# EAGLE design AirSensor (EAGLE 7.5.0)
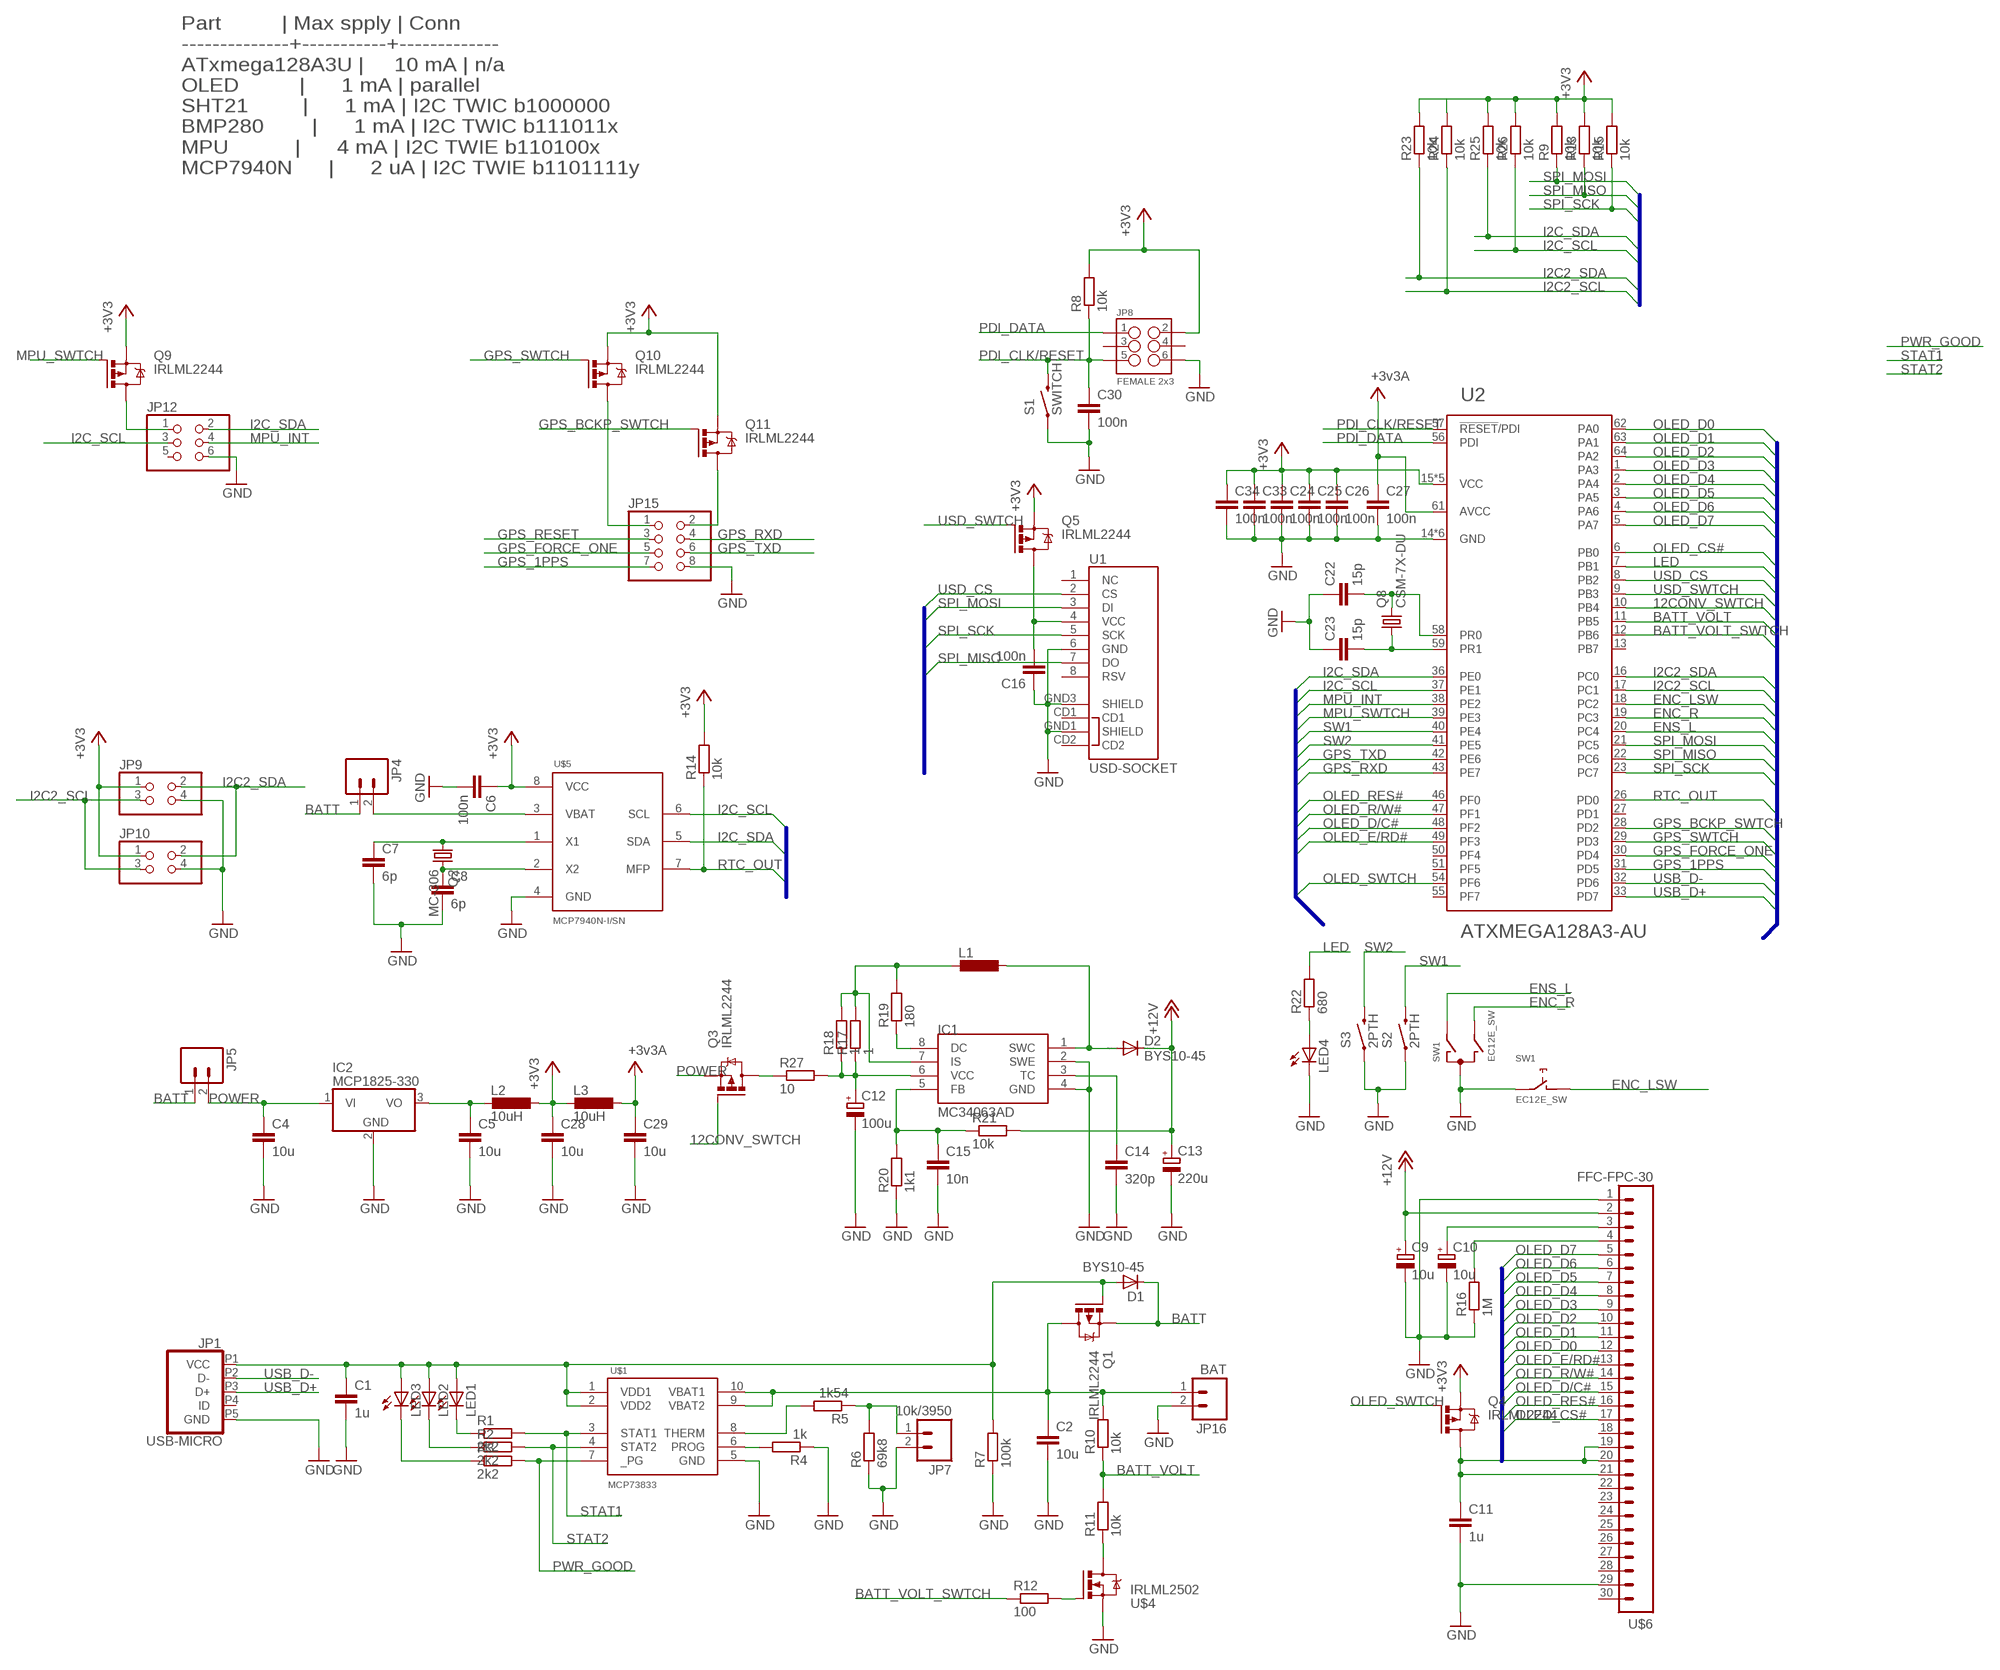
[diagram p0: schematic, sheet 1]

## Parts
C1  1u  C-EUC1206  [C1206]
C2  10u  C-EUC0805  [C0805]
C4  10u  C-EUC0805  [C0805]
C5  10u  C-EUC0805  [C0805]
C6  100n  C-EUC0805  [C0805]
C7  6p  C-EUC0805  [C0805]
C8  6p  C-EUC0805  [C0805]
C9  10u  CPOL-EUUD-4X5,8  [UD-4X5,8_NICHICON]
C10  10u  CPOL-EUUD-4X5,8  [UD-4X5,8_NICHICON]
C11  1u  C-EUC0805  [C0805]
C12  100u  CPOL-EUSANYO_SMD_C6  [SANYO-OSCON_SMD_C6]
C13  220u  CPOL-EUSANYO_SMD_C6  [SANYO-OSCON_SMD_C6]
C14  320p  C-EUC0805  [C0805]
C15  10n  C-EUC0805  [C0805]
C16  100n  C-EUC0805  [C0805]
C22  15p  C-EUC0805  [C0805]
C23  15p  C-EUC0805  [C0805]
C24  100n  C-EUC0805  [C0805]
C25  100n  C-EUC0805  [C0805]
C26  100n  C-EUC0805  [C0805]
C27  100n  C-EUC0805  [C0805]
C28  10u  C-EUC0805  [C0805]
C29  10u  C-EUC0805  [C0805]
C30  100n  C-EUC0805  [C0805]
C33  100n  C-EUC0805  [C0805]
C34  100n  C-EUC0805  [C0805]
D1  BYS10-45  BYS10  [SOD106A]
D2  BYS10-45  MBR0520LT  [SOD123]
IC1  MC34063AD  [SOIC8]
IC2  MCP1825-330  MCP1703DB  [SOT223]
JP1  USB-MICRO  [HIROSE-ZX62-AB-5PA(11)]
JP4  M02PTH  [1X02]
JP5  M02PTH  [1X02]
JP7  10k/3950  M02PTH  [1X02]
JP8  FEMALE 2x3  M03X2FEMALE  [2X3]
JP9  PINHD-2X2/90-SOCKET  [2X02S/90]
JP10  PINHD-2X2/90-SOCKET  [2X02S/90]
JP12  PINHD-2X3/90-SOCKET  [2X03S/90]
JP15  PINHD-2X4/90-SOCKET  [2X04S/90]
JP16  BAT  M02PTH  [1X02]
L1  L-EUTFI0307  [TFI0307]
L2  10uH  L-EUL3225P  [L3225P]
L3  10uH  L-EUL3225P  [L3225P]
LED1  LEDCHIPLED_1206  [CHIPLED_1206]
LED2  LEDCHIPLED_1206  [CHIPLED_1206]
LED3  LEDCHIPLED_1206  [CHIPLED_1206]
LED4  LEDSML1206  [SML1206]
Q1  IRLML2244  IRLML5203  [MICRO3]
Q2  MC-306  [MC-306]
Q3  IRLML2244  IRLML5203  [MICRO3]
Q4  IRLML2244  IRLML5203  [MICRO3]
Q5  IRLML2244  IRLML5203  [MICRO3]
Q8  CSM-7X-DU  [CSM-7X-DU]
Q9  IRLML2244  IRLML5203  [MICRO3]
Q10  IRLML2244  IRLML5203  [MICRO3]
Q11  IRLML2244  IRLML5203  [MICRO3]
R1  2k2  R-EU_R0805  [R0805]
R2  2k2  R-EU_R0805  [R0805]
R3  2k2  R-EU_R0805  [R0805]
R4  1k  R-EU_R0805  [R0805]
R5  1k54  R-EU_R0805  [R0805]
R6  69k8  R-EU_R0805  [R0805]
R7  100k  R-EU_R0805  [R0805]
R8  10k  R-EU_R0805  [R0805]
R9  10k  R-EU_R0805  [R0805]
R10  10k  R-EU_R0805  [R0805]
R11  10k  R-EU_R0805  [R0805]
R12  100  R-EU_R0805  [R0805]
R13  10k  R-EU_R0805  [R0805]
R14  10k  R-EU_R0805  [R0805]
R15  10k  R-EU_R0805  [R0805]
R16  1M  R-EU_R1206  [R1206]
R17  1  R-EU_R0805  [R0805]
R18  1  R-EU_R0805  [R0805]
R19  180  R-EU_R0805  [R0805]
R20  1k1  R-EU_R0805  [R0805]
R21  10k  R-EU_R0805  [R0805]
R22  680  R-EU_R0805  [R0805]
R23  10k  R-EU_R0805  [R0805]
R24  10k  R-EU_R0805  [R0805]
R25  10k  R-EU_R0805  [R0805]
R26  10k  R-EU_R0805  [R0805]
R27  10  R-EU_R1206  [R1206]
S1  SWITCH  SWITCH-MOMENTARY-2SIDE_EZ  [TACTILE-PTH-SIDEEZ]
S2  2PTH  SWITCH-MOMENTARY-2SMD-4  [TACTILE_SWITCH_TALL]
S3  2PTH  SWITCH-MOMENTARY-2SMD-4  [TACTILE_SWITCH_TALL]
SW1  EC12E_SW  [ALPS_EC12E_SW]
U1  USD-SOCKET  [MICROSD_1:1]
U2  ATXMEGA128A3-AU  [TQFP-64A-64]
U$1  MCP73833  [MSOP10]
U$4  IRLML2502  [MICRO3]
U$5  MCP7940N-I/SN  [SOIC8]
U$6  FFC-FPC-30  [FFC-FPC-30V]

## Nets
12CONV_SWTCH: Q3.1(G) U2.10(PB4)
+3V3: C6.1 C24.1 C25.1 C26.1 C28.1 C33.1 C34.1 JP8.2 JP9.1 JP10.1 L2.1 L3.2 Q4.2(S) Q5.2(S) Q9.2(S) Q10.2(S) Q11.2(S) R8.2 R9.2 R13.2 R14.2 R15.2 R23.2 R24.2 R25.2 R26.2 U2.15(VCC) U2.25(VCC) U2.35(VCC) U2.45(VCC) U2.53(VCC) U$5.8(VCC)
+12V: C9.+ C13.+ D2.C R21.2 U$6.2
BATT: D1.K JP4.1 JP5.1 Q1.2(S)
BATT_CHARGE: C2.1 JP16.1 Q1.3(D) R10.2 U$1.9(VBAT2) U$1.10(VBAT1)
BATT_VOLT: R10.1 R11.2 U2.11(PB5)
BATT_VOLT_SWTCH: R12.1 U2.12(PB6)
ENC_LSW: SW1.D U2.18(PC2)
ENC_R: SW1.B U2.19(PC3)
ENS_L: SW1.A U2.20(PC4)
GND: C1.2 C2.2 C4.2 C5.2 C6.2 C7.2 C8.2 C9.- C10.- C11.2 C12.- C13.- C14.2 C15.2 C16.1 C22.1 C23.1 C24.2 C25.2 C26.2 C27.2 C28.2 C29.2 C30.2 C33.2 C34.2 IC1.2(SWE) IC1.4(GND) IC2.2(GND) JP1.P5(GND) JP7.2 JP8.6 JP9.4 JP10.4 JP12.6 JP15.8 JP16.2 LED4.C R4.1 R6.1 R7.1 R16.1 R20.1 S1.1 S2.A2 S3.A2 SW1.C SW1.E U1.6(GND) U1.GND1(SHIELD) U1.GND3(SHIELD) U2.14(GND) U2.24(GND) U2.34(GND) U2.44(GND) U2.52(GND) U2.60(GND) U$1.5(GND) U$4.2(S) U$5.4(GND) U$6.1 U$6.29
GPS_1PPS: JP15.7 U2.31(PD5)
GPS_BCKP_SWTCH: Q11.1(G) U2.28(PD2)
GPS_FORCE_ONE: JP15.5 U2.30(PD4)
GPS_RESET: JP15.3
GPS_RXD: JP15.4 U2.43(PE7)
GPS_SWTCH: Q10.1(G) U2.29(PD3)
GPS_TXD: JP15.6 U2.42(PE6)
I2C2_SCL: JP9.3 JP10.3 R24.1 U2.17(PC1)
I2C2_SDA: JP9.2 JP10.2 R23.1 U2.16(PC0)
I2C_SCL: JP12.3 R26.1 U2.37(PE1) U$5.6(SCL)
I2C_SDA: JP12.2 R25.1 U2.36(PE0) U$5.5(SDA)
LED: R22.2 U2.7(PB1)
MPU_INT: JP12.4 U2.38(PE2)
MPU_SWTCH: Q9.1(G) U2.39(PE3)
N$1: LED1.C R1.1
N$2: C1.1 D1.A JP1.P1(VCC) LED1.A LED2.A LED3.A Q1.1(G) R7.2 U$1.1(VDD1) U$1.2(VDD2)
N$3: C7.1 Q2.1 U$5.1(X1)
N$4: C8.1 Q2.4 U$5.2(X2)
N$5: JP4.2 U$5.3(VBAT)
N$6: LED2.C R2.1
N$7: LED3.C R3.1
N$8: R4.2 U$1.6(PROG)
N$9: R12.2 U$4.1(G)
N$10: R5.2 U$1.8(THERM)
N$11: JP7.1 R5.1 R6.2
N$13: Q3.3(D) R27.1
N$17: R11.1 U$4.3(D)
N$18: C12.+ IC1.6(VCC) R17.1 R18.1 R27.2
N$19: C10.+ U$6.3
N$20: C11.1 Q4.3(D) U$6.19 U$6.20 U$6.21
N$21: IC1.7(IS) L1.2 R17.2 R18.2 R19.2
N$22: R16.2 U$6.4
N$23: IC1.8(DC) R19.1
N$24: D2.A IC1.1(SWC) L1.1
N$25: C14.1 IC1.3(TC)
N$26: C15.1 IC1.5(FB) R20.2 R21.1
N$27: C16.2 Q5.3(D) U1.4(VCC)
N$30: C22.2 Q8.2 U2.58(PR0)
N$31: C23.2 Q8.1 U2.59(PR1)
N$32: C5.1 IC2.3(VO) L2.2
N$33: LED4.A R22.1
N$34: JP12.1 Q9.3(D)
N$39: JP15.1 Q10.3(D)
N$40: JP15.2 Q11.3(D)
OLED_CS#: U2.6(PB0) U$6.17
OLED_D0: U2.62(PA0) U$6.12
OLED_D1: U2.63(PA1) U$6.11
OLED_D2: U2.64(PA2) U$6.10
OLED_D3: U2.1(PA3) U$6.9
OLED_D4: U2.2(PA4) U$6.8
OLED_D5: U2.3(PA5) U$6.7
OLED_D6: U2.4(PA6) U$6.6
OLED_D7: U2.5(PA7) U$6.5
OLED_D/C#: U2.48(PF2) U$6.15
OLED_E/RD#: U2.49(PF3) U$6.13
OLED_R/W#: U2.47(PF1) U$6.14
OLED_RES#: U2.46(PF0) U$6.16
OLED_SWTCH: Q4.1(G) U2.54(PF6)
PDI_CLK/RESET: C30.1 JP8.5 R8.1 S1.2 U2.57(!RESET!/PDI)
PDI_DATA: JP8.1 U2.56(PDI)
POWER: C4.1 IC2.1(VI) JP5.2 Q3.2(S)
PWR_GOOD: R3.2 U$1.7(_PG)
RTC_OUT: R14.1 U2.26(PD0) U$5.7(MFP)
SPI_MISO: R13.1 U1.7(DO) U2.22(PC6)
SPI_MOSI: R9.1 U1.3(DI) U2.21(PC5)
SPI_SCK: R15.1 U1.5(SCK) U2.23(PC7)
STAT1: R1.2 U$1.3(STAT1)
STAT2: R2.2 U$1.4(STAT2)
SW1: S2.B2 U2.40(PE4)
SW2: S3.B2 U2.41(PE5)
USB_D+: JP1.P3(D+) U2.33(PD7)
USB_D-: JP1.P2(D-) U2.32(PD6)
USD_CS: U1.2(CS) U2.8(PB2)
USD_SWTCH: Q5.1(G) U2.9(PB3)
V+: C27.1 C29.1 L3.1 U2.61(AVCC) ; supply symbol labelled +3v3A
Unconnected: JP1.P4(ID) JP8.3 JP8.4 JP12.5 SW1.GND1(G) SW1.GND2(G) U1.1(NC) U1.8(RSV) U1.CD1 U1.CD2 U2.13(PB7) U2.27(PD1) U2.50(PF4) U2.51(PF5) U2.55(PF7) U$6.18 U$6.22 U$6.23 U$6.24 U$6.25 U$6.26 U$6.27 U$6.28 U$6.30

## Buses
B$1
B$2
B$3
B$5
B$4

## Notes on the sheet
- Part          | Max spply | Conn
  --------------+-----------+-------------
  ATxmega128A3U |     10 mA | n/a
  OLED          |      1 mA | parallel
  SHT21         |      1 mA | I2C TWIC b1000000
  BMP280        |      1 mA | I2C TWIC b111011x
  MPU           |      4 mA | I2C TWIE b110100x
  MCP7940N      |      2 uA | I2C TWIE b1101111y

## Library data of the parts
C1 C2 C4-C8 C11 C14-C16 C22-C30 C33 C34 = rcl:C-EU: CAPACITOR, European symbol
C9 C10 C12 C13 = rcl:CPOL-EU: POLARIZED CAPACITOR, European symbol
D1 = telefunken:BYS10: DIODE; MPN: BYS10/45; OC_FARNELL: 9549188; OC_NEWARK: 96K7236
D2 = diode:MBR0520LT: SCHOTTKY BARRIER RECTIFIER Source: http://onsemi.com .. MBR0520LT1-D.pdf
IC1 = mc34063:MC34063
IC2 = linear:MCP1703: 250 mA, 16V, Low Quiescent Current LDO Regulator Source: http://ww1.microchip.com/downloads/en/DeviceDoc/22049b.pdf
JP1 = daspilker:USB-MICRO
JP4 JP5 JP7 JP16 = SparkFun-Connectors:M02: Standard 2-pin 0.1" header. Use with - straight break away headers ( PRT-00116) - right angle break away headers (PRT-00553) - swiss pins (PRT-00743) - machine pins (PRT-00117) - female headers (PRT-00115) Molex polarized connector foot print use with: PRT-08233 with associated crimp pins and housings. 2.54_SCREWTERM for use with PRT-10571. 3.5mm Screw Terminal footprints for PRT-08084 5mm Screw Terminal footprints for use with PRT-08432
JP8 = SparkFun-Connectors:M03X2: 2x3 .1" header. Shrouded, with keying- CONN-10681 SMT- CONN-11415 Pogo pins- HW-11044; PROD_ID: CONN-11566
JP9 JP10 = Misc:PINHD-2X2: PIN HEADER
JP12 = Misc:PINHD-2X3: PIN HEADER
JP15 = Misc:PINHD-2X4: PIN HEADER
L1-L3 = rcl:L-EU: INDUCTOR, European symbol
LED1-LED4 = led:LED: LED OSRAM: - CHIPLED LG R971, LG N971, LY N971, LG Q971, LY Q971, LO R971, LY R971 LH N974, LH R974 LS Q976, LO Q976, LY Q976 LO Q996 - Hyper CHIPLED LW Q18S LB Q993, LB Q99A, LB R99A - SideLED LS A670, LO A670, LY A670, LG A670, LP A670 LB A673, LV A673, LT A673, LW A673 LH A674 LY A675 LS A676, LA A676, LO A676, LY A676, LW A676 LS A679, LY A679, LG A679 - Hyper Micro SIDELED® LS Y876, LA Y876, LO Y876, LY Y876 LT Y87S - SmartLED LW L88C, LW L88S LB L89C, LB L89S, LG L890 LS L89K, LO L89K, LY L89K LS L896, LA L896, LO L896, LY L896 - TOPLED LS T670, LO T670, LY T670, LG T670, LP T670 LSG T670, LSP T670, LSY T670, LOP T670, LYG T670 LG T671, LOG T671, LSG T671 LB T673, LV T673, LT T673, LW T673 LH T674 LS T676, LA T676, LO T676, LY T676, LB T676, LH T676, LSB T676, LW T676 LB T67C, LV T67C, LT T67C, LS T67K, LO T67K, LY T67K, LW E67C LS E67B, LA E67B, LO E67B, LY E67B, LB E67C, LV E67C, LT E67C LW T67C LS T679, LY T679, LG T679 LS T770, LO T770, LY T770, LG T770, LP T770 LB T773, LV T773, LT T773, LW T773 LH T774 LS E675, LA E675, LY E675, LS T675 LS T776, LA T776, LO T776, LY T776, LB T776 LHGB T686 LT T68C, LB T68C - Hyper Mini TOPLED® LB M676 - Mini TOPLED Santana® LG M470 LS M47K, LO M47K, LY M47K Source: http://www.osram.convergy.de LUXEON: - LUMILED® LXK2-PW12-R00, LXK2-PW12-S00, LXK2-PW14-U00, LXK2-PW14-V00 LXK2-PM12-R00, LXK2-PM12-S00, LXK2-PM14-U00 LXK2-PE12-Q00, LXK2-PE12-R00, LXK2-PE12-S00, LXK2-PE14-T00, LXK2-PE14-U00 LXK2-PB12-K00, LXK2-PB12-L00, LXK2-PB12-M00, LXK2-PB14-N00, LXK2-PB14-P00, LXK2-PB14-Q00 LXK2-PR12-L00, LXK2-PR12-M00, LXK2-PR14-Q00, LXK2-PR14-R00 LXK2-PD12-Q00, LXK2-PD12-R00, LXK2-PD12-S00 LXK2-PH12-R00, LXK2-PH12-S00 LXK2-PL12-P00, LXK2-PL12-Q00, LXK2-PL12-R00 Source: www.luxeon.com KINGBRIGHT: KA-3528ASYC Source: www.kingbright.com
Q1 Q3-Q5 Q9-Q11 = transistor-power:IRLML5203: HEXFET P-Channel Power MOSFET
Q2 = crystal:MC-306: kHz RANGE CRYSTAL UNIT SMD Source: MC-306_405_406_E07X.PDF Homepage <http://www.epsontoyocom.co.jp>; MPN: MC-306 60.0KHZ 100PPM ,12.5PF; OC_FARNELL: 1278040; OC_NEWARK: 31M5576
Q8 = crystal:CSM-7X-DU: SMD CRYSTAL Source: www.ecsxtal.com .. Crystal 3.6864MHz CSM_7X_DU.PDF; OC_FARNELL: unknown; OC_NEWARK: unknown
R1-R27 = rcl:R-EU_: RESISTOR, European symbol
S1 = SparkFun-Electromechanical:SWITCH-MOMENTARY-2: Various NO switches- pushbuttons, reed, etc
S2 S3 = SparkFun-Electromechanical:SWITCH-MOMENTARY-2: Various NO switches- pushbuttons, reed, etc; PROD_ID: SWCH-11966
SW1 = switch-alps:EC12E_SW: ALPS rotary Encoder EC12E series with switch; MPN: EC12E2424407; OC_FARNELL: 1520813; OC_NEWARK: 74M1068
U1 = SparkFun-Connectors:USD-SOCKET: microSD Socket Push-push type uSD socket. Schematic element and footprint production proven. Spark Fun Electronics SKU : PRT-00127. tDoc lines correctly indicate media card edge positions when inserting (unlocked, locked, depressed). NOTE: CD1 and CD2 are connected internally; PROD_ID: CONN-07820
U2 = atmega-atxmega:ATXMEGA128A3: 8/16-bit XMEGA A3 Microcontroller Features High-performance, Low-power 8/16-bit Atmel® AVR® XMEGATM Microcontroller Non-volatile Program and Data Memories – 64 KB - 256 KB of In-System Self-Programmable Flash – 4 KB - 8 KB Boot Code Section with Independent Lock Bits – 2 KB - 4 KB EEPROM – 4 KB - 16 KB Internal SRAM Peripheral Features – Four-channel DMA Controller with support for external requests – Eight-channel Event System – Seven 16-bit Timer/Counters Four Timer/Counters with 4 Output Compare or Input Capture channels Three Timer/Counters with 2 Output Compare or Input Capture channels High Resolution Extensions on all Timer/Counters Advanced Waveform Extension on one Timer/Counter – Seven USARTs IrDA Extension on 1 USART – AES and DES Crypto Engine – Two Two-wire Interfaces with dual address match (I2C and SMBus compatible) – Three SPI (Serial Peripheral Interfaces) – 16-bit Real Time Counter with Separate Oscillator – Two Eight-channel, 12-bit, 2 Msps Analog to Digital Converters – One Two-channel, 12-bit, 1 Msps Digital to Analog Converter – Four Analog Comparators with Window compare function – External Interrupts on all General Purpose I/O pins – Programmable Watchdog Timer with Separate On-chip Ultra Low Power Oscillator Special Microcontroller Features – Power-on Reset and Programmable Brown-out Detection – Internal and External Clock Options with PLL – Programmable Multi-level Interrupt Controller – Sleep Modes: Idle, Power-down, Standby, Power-save, Extended Standby – Advanced Programming, Test and Debugging Interfaces JTAG (IEEE 1149.1 Compliant) Interface for test, debug and programming PDI (Program and Debug Interface) for programming, test and debugging I/O and Packages – 50 Programmable I/O Lines – 64-lead TQFP – 64-pad QFN Operating Voltage – 1.6 – 3.6V Speed performance – 0 – 12 MHz @ 1.6 – 3.6V – 0 – 32 MHz @ 2.7 – 3.6V
U$1 = Misc:MCP73833
U$4 = Misc:IRLML2502: HEXFET N-Channel Power MOSFET
U$5 = Misc:MCP7940N: Battery-Backed I2C™ Real-Time Clock/Calendar with SRAM
U$6 = Misc:FFC-FPC-30

## Board
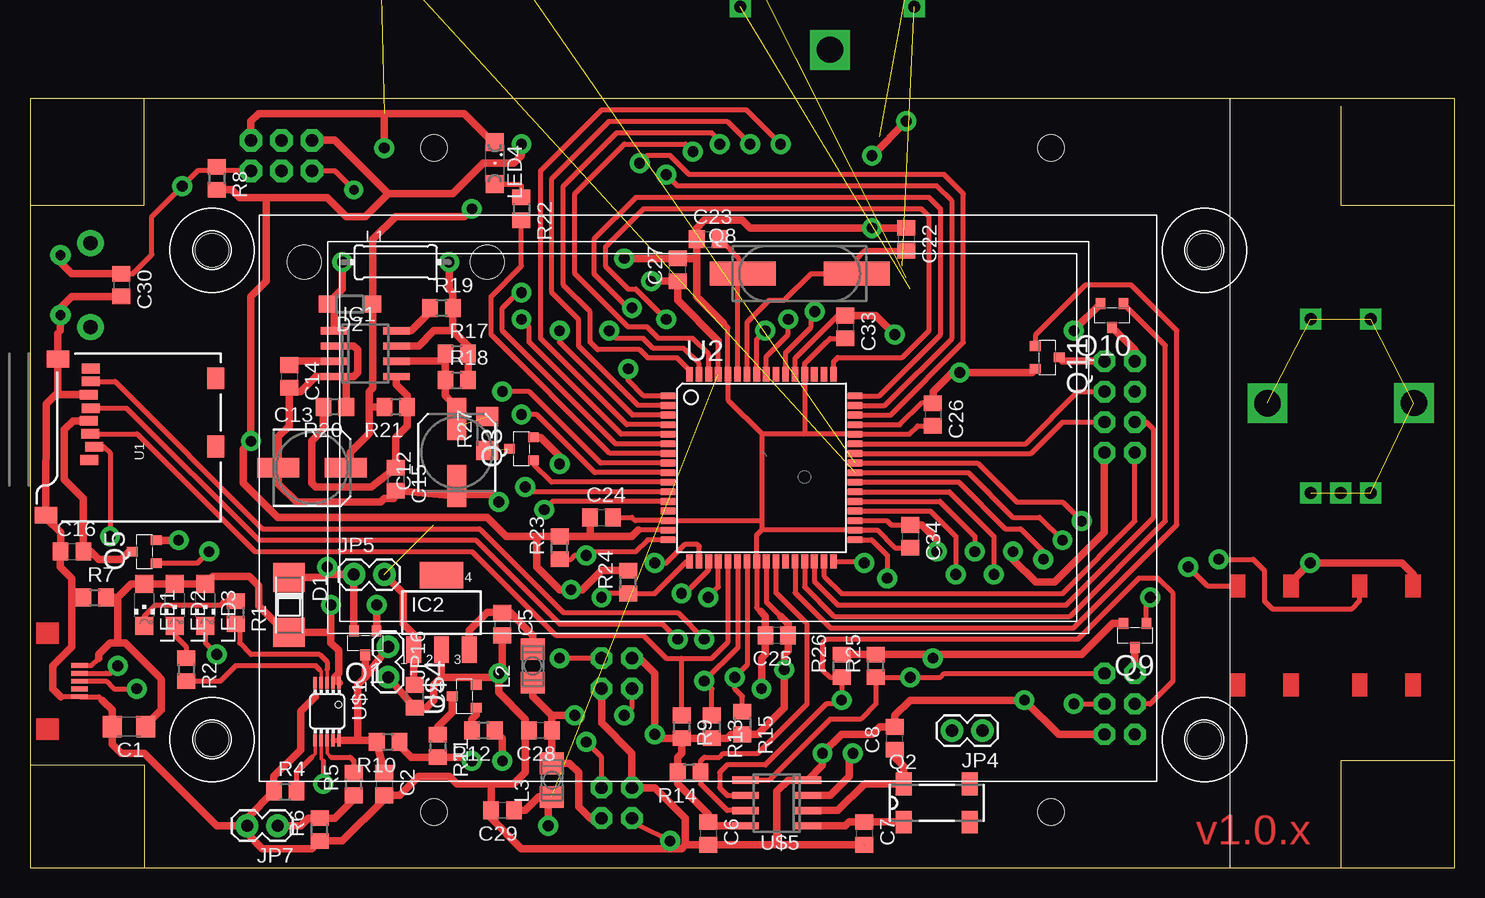
[diagram p1: board, top side]
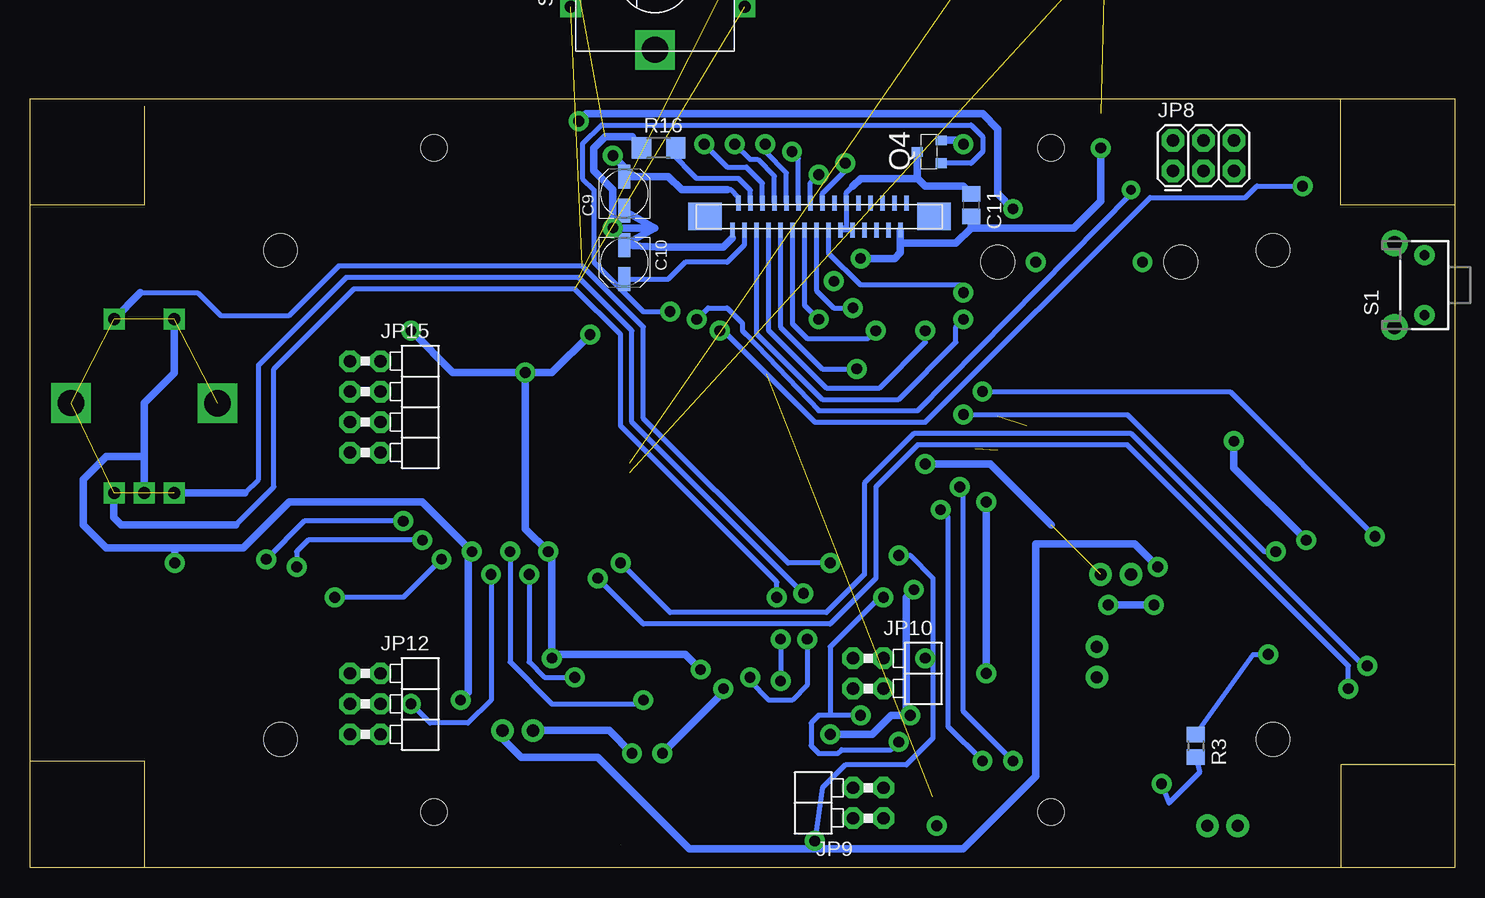
[diagram p2: board, bottom side, seen from below]

Size 118.75 x 64.14 mm. Coordinates in mm from the lower left corner, seen from the top.
Outline: 9.53,0 0,0 0,8.57
Outline: 9.53,0 109.22,0
Outline: 0,55.24 0,64.12 118.75,64.12 118.75,55.24
Outline: 0,55.24 0,8.57
Outline: 109.22,0 118.75,0 118.75,8.89
Outline: 118.75,8.89 118.75,55.24
Outline: 0,55.24 9.53,55.24 9.53,64.14
Outline: 0,8.57 9.53,8.57 9.53,0
Outline: 118.75,8.89 109.22,8.89 109.22,0
Outline: 109.22,63.5 109.22,55.24 118.75,55.24
Copper layers (1*16): Top 0.035mm / dielectric 1.5mm / Bottom 0.035mm
Design rules "default *": minimum track width 10mil, minimum drill 24mil, track to track 8mil, track to pad 8mil, pad to pad 8mil, via to via 8mil, smd to smd 8mil, copper to edge 40mil, drill to drill 8mil, minimum pad ring 15mil, minimum via ring 15mil, stop-mask expansion 4mil, vias tented up to drill 0mil, thermal gap 10mil
Holes 2.2 mm at 33.66,60.01 85.09,60.01 85.09,4.64 33.66,4.64
Holes 2.8 mm at 38.1,50.48 22.86,50.48

### Footprints (pad centres in the part's own frame; a part is rotated, then mirrored left to right if it is on the bottom)
C1206 = smd 1.6 x 1.8: 1 -1.4,0; 2 1.4,0
C0805 = smd 1.3 x 1.5: 1 -0.95,0; 2 0.95,0
UD-4X5,8_NICHICON = smd 2 x 1: + 1.425,0; - -1.425,0
SANYO-OSCON_SMD_C6 = smd 3.5 x 1.6: + 2.8,0; - -2.8,0
SOD106A = smd 2.4 x 2.6: A 2.3,0; K -2.3,0
SOD123 = smd 1.4 x 1.4: A 1.9,0; C -1.9,0
SOIC8 = smd 0.6 x 2.2: 1 -1.905,-2.6; 2 -0.635,-2.6; 3 0.635,-2.6; 4 1.905,-2.6; 5 1.905,2.6; 6 0.635,2.6; 7 -0.635,2.6; 8 -1.905,2.6
SOT223 = smd 1.219 x 2.235: 1 -2.311,-3.099; 2 0,-3.099; 3 2.311,-3.099 | smd 3.6 x 2.2: 4 0,3.099
HIROSE-ZX62-AB-5PA(11) = smd 0.4 x 1.35 bottom: P1 1.3,4.125; P2 0.65,4.125; P3 0,4.125; P4 -0.65,4.125; P5 -1.3,4.125
1X02 = drill 1.016 pad 1.88: 1 0,0; 2 2.54,0
2X3 = drill 1.016 pad 1.88 octagon: 1 0,0; 2 0,2.54; 3 2.54,0; 4 2.54,2.54; 5 5.08,0; 6 5.08,2.54
2X02S/90 = drill 1.016 octagon: 1 -1.27,-6.35; 2 -1.27,-3.81; 3 1.27,-6.35; 4 1.27,-3.81
2X03S/90 = drill 1.016 octagon: 1 -2.54,-6.35; 2 -2.54,-3.81; 3 0,-6.35; 4 0,-3.81; 5 2.54,-6.35; 6 2.54,-3.81
2X04S/90 = drill 1.016 octagon: 1 -3.81,-6.35; 2 -3.81,-3.81; 3 -1.27,-6.35; 4 -1.27,-3.81; 5 1.27,-6.35; 6 1.27,-3.81; 7 3.81,-6.35; 8 3.81,-3.81
TFI0307 = drill 0.9 pad 1.5: 1 -4.445,0; 2 4.445,0
L3225P = smd 1.8 x 2: 1 -1.4,0; 2 1.4,0
CHIPLED_1206 = smd 1.5 x 1.5: A 0,-1.75; C 0,1.75
SML1206 = smd 1.5 x 1.5: A 1.75,0; C -1.75,0
MICRO3 = smd 0.8 x 0.9: 1 -0.95,-1; 2 0.95,-1; 3 0,1
MC-306 = smd 1.3 x 1.9: 1 -2.75,-1.6; 2 2.75,-1.6; 3 2.75,1.6; 4 -2.75,1.6
CSM-7X-DU = smd 5.5 x 2: 1 -4.75,0; 2 4.75,0
R0805 = smd 1.3 x 1.5: 1 -0.95,0; 2 0.95,0
R1206 = smd 1.6 x 1.803: 1 -1.422,0; 2 1.422,0
TACTILE-PTH-SIDEEZ = drill 0.8 pad 1.7: 1 -2.5,0; 2 2.5,0 | drill 1.2 pad 2.2: ANCHOR1 -3.5,2.5; ANCHOR2 3.5,2.5
TACTILE_SWITCH_TALL = smd 1.55 x 1.3: A1 -3.975,-2.25; A2 3.975,-2.25; B1 -3.975,2.25; B2 3.975,2.25
ALPS_EC12E_SW = drill 1 square: A -2.5,-7.5; B 2.5,-7.5; C 0,-7.5; D -2.5,7; E 2.5,7 | drill 2.2 square: GND1 -6.1,0; GND2 6.1,0
MICROSD_1:1 = smd 0.8 x 1.5: 1 5.096,10.919; 2 6.218,10.519; 3 7.274,10.853; 4 8.367,10.982; 5 9.421,10.828; 6 10.539,10.973; 7 11.648,10.819; 8 12.721,10.819 | smd 1.8 x 1.4: CD1 11.92,0.4; CD2 6.22,0.4 | smd 1.4 x 1.9: GND1 0.497,14.55; GND3 13.52,13.55
TQFP-64A-64 = smd 1.194 x 0.559: 1 -7.8,6; 2 -7.8,5.2; 3 -7.8,4.4; 4 -7.8,3.6; 5 -7.8,2.8; 6 -7.8,2; 7 -7.8,1.2; 8 -7.8,0.4; 9 -7.8,-0.4; 10 -7.8,-1.2; 11 -7.8,-2; 12 -7.8,-2.8; 13 -7.8,-3.6; 14 -7.8,-4.4; 15 -7.8,-5.2; 16 -7.8,-6; 33 7.8,-6; 34 7.8,-5.2; 35 7.8,-4.4; 36 7.8,-3.6; 37 7.8,-2.8; 38 7.8,-2; 39 7.8,-1.2; 40 7.8,-0.4; 41 7.8,0.4; 42 7.8,1.2; 43 7.8,2; 44 7.8,2.8; 45 7.8,3.6; 46 7.8,4.4; 47 7.8,5.2; 48 7.8,6 | smd 0.559 x 1.194: 17 -6,-7.8; 18 -5.2,-7.8; 19 -4.4,-7.8; 20 -3.6,-7.8; 21 -2.8,-7.8; 22 -2,-7.8; 23 -1.2,-7.8; 24 -0.4,-7.8; 25 0.4,-7.8; 26 1.2,-7.8; 27 2,-7.8; 28 2.8,-7.8; 29 3.6,-7.8; 30 4.4,-7.8; 31 5.2,-7.8; 32 6,-7.8; 49 6,7.8; 50 5.2,7.8; 51 4.4,7.8; 52 3.6,7.8; 53 2.8,7.8; 54 2,7.8; 55 1.2,7.8; 56 0.4,7.8; 57 -0.4,7.8; 58 -1.2,7.8; 59 -2,7.8; 60 -2.8,7.8; 61 -3.6,7.8; 62 -4.4,7.8; 63 -5.2,7.8; 64 -6,7.8
MSOP10 = smd 0.3 x 1.02: 1 -1,-2.4; 2 -0.5,-2.4; 3 0,-2.4; 4 0.5,-2.4; 5 1,-2.4; 6 1,2.4; 7 0.5,2.4; 8 0,2.4; 9 -0.5,2.4; 10 -1,2.4
FFC-FPC-30V = smd 0.4 x 1.25: 1 -7.5,-1.125; 2 -7,1.125; 3 -6.5,-1.125; 4 -6,1.125; 5 -5.5,-1.125; 6 -5,1.125; 7 -4.5,-1.125; 8 -4,1.125; 9 -3.5,-1.125; 10 -3,1.125; 11 -2.5,-1.125; 12 -2,1.125; 13 -1.5,-1.125; 14 -1,1.125; 15 -0.5,-1.125; 16 0,1.125; 17 0.5,-1.125; 18 1,1.125; 19 1.5,-1.125; 20 2,1.125; 21 2.5,-1.125; 22 3,1.125; 23 3.5,-1.125; 24 4,1.125; 25 4.5,-1.125; 26 5,1.125; 27 5.5,-1.125; 28 6,1.125; 29 6.5,-1.125; 30 7,1.125 | smd 2.8 x 2.3: P$1 -9.8,0; P$2 9.3,0
RET012864LYPP3N = hole 2.8: -41.35,20.68; 41.35,20.68; -41.35,-20.1; 41.35,-20.1

### Placement (x,y rotation side)
C1  8.26,11.75 180 top
C2  29.53,6.99 270 top
C4  32.07,14.29 270 top
C5  39.37,20.32 270 top
C6  56.52,2.86 270 top
C7  69.53,2.86 270 top
C8  72.07,10.79 90 top
C9  69.22,56.2 90 bottom
C10  69.22,50.48 270 bottom
C11  40.32,55.24 270 bottom
C12  35.56,34.61 90 top
C13  23.5,33.34 0 top
C14  21.59,40.96 270 top
C15  30.48,32.38 270 top
C16  3.49,26.35 0 top
C22  73.03,52.39 270 top
C23  56.52,52.39 0 top
C24  47.62,29.21 0 top
C25  62.23,19.37 180 top
C26  75.25,37.78 270 top
C27  53.98,49.85 90 top
C28  42.55,11.43 180 top
C29  39.37,4.76 180 top
C30  7.62,48.58 270 top
C33  67.94,45.09 270 top
C34  73.34,27.62 270 top
D1  21.59,21.91 270 top
D2  26.67,46.99 180 top
IC1  27.94,42.86 270 top
IC2  34.29,21.27 0 top
JP1  0,15.56 90 bottom
JP4  79.38,11.43 180 top
JP5  26.99,24.45 0 top
JP7  20.64,3.49 180 top
JP8  23.5,58.1 0 bottom
JP9  53.98,5.4 90 bottom
JP10  43.81,16.19 270 bottom
JP12  85.72,13.65 270 bottom
JP15  85.72,38.42 270 bottom
JP16  29.84,18.41 270 top
L1  30.48,50.48 0 top
L2  41.91,16.83 90 top
L3  43.5,7.3 90 top
LED1  9.53,21.91 180 top
LED2  12.06,21.91 180 top
LED3  14.61,21.91 180 top
LED4  38.73,58.74 270 top
Q1  27.94,18.73 180 top
Q2  75.56,5.4 0 top
Q3  40.96,34.92 90 top
Q4  43.81,59.69 90 bottom
Q5  9.53,26.35 90 top
Q8  64.14,49.53 0 top
Q9  92.08,19.37 180 top
Q10  90.17,46.04 180 top
Q11  84.77,42.55 270 top
R1  17.14,21.27 270 top
R2  13.02,16.51 270 top
R3  21.59,10.16 270 bottom
R4  21.27,6.35 0 top
R5  26.99,6.99 90 top
R6  24.13,3.17 90 top
R7  5.4,22.54 0 top
R8  15.56,57.47 270 top
R9  54.29,11.75 270 top
R10  29.84,10.48 180 top
R11  33.97,10.16 270 top
R12  37.78,11.43 180 top
R13  56.83,11.75 270 top
R14  54.93,7.94 180 top
R15  59.37,12.06 270 top
R16  66.36,60.01 0 bottom
R17  35.56,42.86 0 top
R18  35.56,40.64 0 top
R19  34.29,46.67 0 top
R20  25.4,38.42 180 top
R21  30.48,38.42 180 top
R22  40.96,54.93 270 top
R23  44.13,26.67 90 top
R24  49.85,23.81 90 top
R25  70.48,16.83 90 top
R26  67.63,16.83 90 top
R27  38.1,36.2 90 top
S1  2.54,48.58 90 bottom
S2  33.02,78.74 180 top  (outside the outline)
S3  43.18,78.74 180 top  (outside the outline)
SW1  66.67,74.3 90 bottom  (outside the outline)
U1  15.88,28.89 90 top
U2  60.96,33.34 0 top
U$1  24.77,13.02 180 top
U$4  36.2,14.29 90 top
U$5  62.23,5.4 90 top
U$6  52.7,54.29 0 bottom
U$7  [RET012864LYPP3N]  56.52,30.8 0 top

### Tracks (layer width: path | path; a pad name or v marks a point on that pad's centre or on a via)
12CONV_SWTCH
  Top 0.406: U2.10 43.48,32.14 41.96,33.66 Q3.1 41.91,33.98
+3V3  (via drill 0.9)
  Top 0.406: 46.67,27.62 C24.1 | U2.15 50.68,28.14 | U2.25 61.36,22.14 62.55,20.95 | U2.53 63.76,42.49 67.31,46.04 C33.1 | U2.45 72.5,36.94 74.3,38.73 74.61,38.73 C26.1 | U2.35 71.39,28.94 71.75,28.57 73.02,28.57 C34.1
  Top 0.61: R9.2 R13.2 58.1,10.79 58.42,11.12 R15.2 60.65,11.11 60.96,11.43 62.87,13.34 v62.87,16.51 62.87,17.78 63.18,18.09 C25.1 63.18,20.32 62.55,20.95 | 46.67,27.62 50.16,27.62 50.68,28.14 | C34.1 73.03,28.57 74.3,28.57 75.56,27.3 v75.56,26.35 | C26.1 75.25,39.69 75.88,40.32 76.83,41.27 v77.47,41.27 83.19,41.27 83.5,41.28 Q11.2 | 42.23,27.62 41.27,27.62 39.69,27.62 38.1,29.21 20.64,29.21 17.78,32.07 17.78,34.92 v18.41,35.56 18.41,47.62 19.68,48.9 19.68,55.88 | 42.23,27.62 R23.2 | R23.2 45.72,27.62 46.67,27.62 C24.1 | U$5.8 56.52,3.49 C6.1 56.52,4.45 53.98,6.99 53.98,7.62 R14.2 | Q5.2 v12.38,27.3 | L2.1 41.91,14.29 43.49,12.7 | C28.1 43.49,12.7 | C28.1 L3.2 44.95,8.7 45.72,7.94 45.72,5.08 46.67,4.13 JP9.1 | R24.2 47.62,24.77 46.04,23.18 v45.09,23.18 44.13,23.18 42.23,25.08 42.23,27.62 | JP10.1 50.8,17.46 52.07,16.19 52.07,14.61 52.07,11.43 v52.07,11.12 v52.07,11.11 52.38,10.8 R9.2 | 43.5,11.75 43.49,11.74 C28.1 | R26.2 R25.2 75.25,17.78 v75.25,17.46 75.25,17.78 87.63,17.78 90.22,20.37 Q9.2 | v72.07,44.45 70.49,46.03 C33.1 | 29.84,56.2 25.4,60.64 JP8.2 | 42.23,27.62 | R23.2 | v87,44.77 87,44.81 Q10.2 | 29.84,56.2 35.24,56.2 37.78,58.74 40.32,58.74 40.96,59.37 v40.96,60.33 | R14.2 | v45.4,12.7 43.5,12.7 43.49,12.7 | R14.2 53.98,9.21 54.29,9.53 R9.2 | R8.2 16.82,56.52 17.46,55.88 19.68,55.88 | 19.68,55.88 24.77,55.88 26.35,54.29 27.94,54.29 29.84,56.2
  Bottom 0.61: v12.38,27.3 18.41,33.34 v18.41,35.56 | v45.09,23.18 45.72,22.54 45.72,13.02 v45.4,12.7 46.99,12.7 48.58,11.11 v52.07,11.11 | v77.47,41.27 77.47,28.26 v75.56,26.35 75.25,26.04 v75.25,17.46 75.25,17.78 64.14,17.78 v62.87,16.51 | v87,44.77 83.5,41.27 v77.47,41.27 | v72.07,44.45 75.25,41.27 v77.47,41.27 | Q4.2 41.27,60.64 v40.96,60.33
+12V  (via drill 0.9)
  Top 0.61: C13.+ 26.67,33.53 26.67,34.61 28.26,36.2 28.26,38.42 | v36.83,54.93 36.2,54.29 30.48,54.29 28.57,52.39 28.57,47.31 D2.C 28.57,46.04 28.58,46.04 28.57,45.41 28.57,40.01 28.26,39.69 28.26,38.42 | 29.84,38.42 R21.2 28.26,38.42 | v73.03,62.23 v70.17,59.37
  Bottom 0.406: U$6.2 59.7,55.9 60.33,56.52 60.64,56.52
  Bottom 0.61: v36.83,54.93 38.1,56.2 38.1,61.59 39.37,62.87 72.39,62.87 v73.03,62.23 | v70.17,59.37 68.42,57.62 C9.+ 65.56,57.62 64.45,56.52 60.64,56.52
BATT  (via drill 0.9)
  Top 0.61: Q1.2 JP5.1 24.77,24.45 | D1.K 24.52,24.21 24.77,24.45 | 24.77,24.45 v24.77,25.08
  Bottom 0.61: v24.77,25.08 26.67,26.99 34.92,26.99 34.92,7.62 40.96,1.59 63.82,1.59 71.44,9.21 77.79,9.21 79.38,10.79 JP4.1
BATT_CHARGE
  Top 0.406: U$1.9 U$1.10
  Top 0.61: C2.1 R10.2 28.75,10.62 27.3,10.62 | U$1.10 27.3,10.62 | 27.3,10.62 27.3,15.24 27.94,15.88 | Q1.3 27.94,15.88 | JP16.1 27.94,15.88
BATT_VOLT  (via drill 0.9)
  Top 0.406: U2.11 41.37,31.34 v41.27,31.75
  Top 0.61: R10.1 30.8,10.16 31.75,9.21 33.34,9.21 R11.2 36.52,9.21 v36.83,8.89
  Bottom 0.406: v36.83,8.89 40.96,13.02 40.96,31.43 v41.27,31.75
BATT_VOLT_SWTCH  (via drill 0.9)
  Top 0.406: U2.12 43.55,30.54 v42.86,29.84
  Top 0.61: R12.1 39.37,10.79 v39.37,8.89
  Bottom 0.406: v39.37,8.89 42.23,11.75 42.23,29.21 v42.86,29.84
ENC_LSW  (via drill 0.9)  (1 unrouted)
  Top 0.406: v52.07,25.4 53.02,25.4 54.61,26.99 55.56,26.99 55.78,26.77 55.78,25.51 U2.18
  Bottom 0.406: v52.07,25.4 55.56,25.4 67.63,37.47 67.63,45.09 72.71,50.16 93.03,50.16 97.16,46.04 102.87,46.04 104.78,47.94 109.54,47.94
  Bottom 0.61: 109.54,47.94 111.76,45.72
ENC_R  (via drill 0.9)  (1 unrouted)
  Top 0.406: v54.29,22.86 54.61,22.86 56.56,24.81 U2.19
  Bottom 0.406: v54.29,22.86 68.58,37.15 68.58,44.77 73.03,49.21 92.39,49.21 99.69,41.91 99.69,32.38 100.84,31.23
  Bottom 0.61: 100.84,31.23 106.56,31.23
ENS_L  (via drill 0.9)  (1 unrouted)
  Top 0.406: v56.52,22.54 57.36,23.39 U2.20
  Bottom 0.406: v56.52,22.54 56.52,23.81 69.53,36.83 69.53,44.45 73.34,48.26 91.76,48.26 98.42,41.59 98.42,31.75 101.6,28.57
  Bottom 0.61: 111.76,31.2 111.76,29.21 111.12,28.57 101.6,28.57
GND  (via drill 0.9)  (5 unrouted)
  Top 0.305: U$1.5 23.77,14.56
  Top 0.406: 23.77,14.56 23.77,14.24 | 57.78,45.4 58.16,45.03 U2.60 58.16,38.99 60.96,36.2 | C26.2 73.98,36.83 73.28,36.14 U2.44 64.45,36.14 | C34.2 73.02,26.67 72.07,26.67 70.61,28.14 U2.34 60.96,28.14 | 64.45,36.14 61.02,36.14 60.96,36.2 | 60.96,36.2 60.96,28.89 | 60.96,28.89 60.96,28.14 | 2.57,14.26 JP1.P5 5.75,14.26 6.03,13.97 | 64.45,36.14 64.56,36.24 U2.52 64.56,42.02 66.36,43.81 66.68,44.13 C33.2 | 60.96,28.89 60.91,28.94 U2.14 50.44,28.94 50.16,29.21 C24.2 | 60.96,28.14 60.56,27.74 U2.24 60.56,21.67 60.88,21.36
  Top 0.61: 62.23,1.91 62.55,1.91 63.81,1.91 C7.2 | 62.23,1.91 62.23,6.35 63.18,7.3 U$5.4 66.04,8.51 v66.04,9.53 67.63,11.11 70.17,11.11 70.8,11.75 C8.2 72.07,12.7 73.34,13.97 v82.87,13.97 85.72,11.11 JP12.6 | 23.77,14.24 22.54,13.02 22.54,9.84 20.32,7.62 R4.1 | C25.2 | 6.03,13.97 6.86,13.15 C1.2 6.86,10.29 7.62,9.53 9.53,9.53 15.56,3.49 JP7.2 | U1.6 2.54,39.43 | 2.54,39.43 2.16,39.43 1.37,38.65 U1.GND1 1.32,29.16 2.54,27.94 C16.1 2.54,26.98 2.54,25.08 3.49,24.13 3.49,22.54 | 2.54,39.43 2.33,39.65 U1.GND3 2.33,44.55 2.54,44.77 S1.1 2.54,46.67 3.5,47.63 C30.2 | JP15.8 89.53,27.94 85.41,23.81 83.82,23.81 81.92,25.72 v81.92,26.35 | 2.57,14.26 1.91,14.92 1.91,16.83 3.49,18.41 3.49,22.54 | IC1.2 26.99,43.5 27.3,43.18 27.3,41.27 26.99,40.96 26.35,40.96 | 26.35,40.96 IC1.4 23.81,40.96 22.54,39.69 21.46,39.69 C14.2 21.59,36.83 20.7,35.94 C13.- 20.7,32.01 22.23,30.48 29.21,30.48 29.53,30.8 30.29,30.8 C15.2 35.43,30.98 35.56,31.11 | 54.61,1.91 54.29,1.59 40.96,1.59 38.42,4.13 C29.2 38.42,6.67 38.42,6.99 | 54.61,1.91 C6.2 61.91,1.91 62.23,1.91 | R4.1 | C12.- 35.56,31.11 | 35.56,31.11 38.42,31.11 v39.05,30.48 | 38.42,6.99 40.32,6.99 41.27,7.94 41.27,11.75 | 41.27,11.75 41.27,12.38 39.05,14.61 v39.05,16.19 | C5.2 39.37,16.51 v39.05,16.19 | C28.2 41.27,11.75 | C22.1 71.75,53.34 v70.17,53.34 60.01,53.34 59.37,53.98 56.2,53.98 55.56,53.34 C23.1 55.38,52.2 55.56,51.75 55.56,50.8 | 55.56,50.8 55.56,47.62 57.78,45.4 | 55.56,50.8 54.92,50.8 C27.2 50.17,50.8 v49.53,50.8 | v60.96,14.92 60.96,17.46 61.28,17.78 C25.2 | C25.2 61.28,20.95 60.88,21.36 | R7.1 3.49,22.54 | 29.53,62.87 v29.53,60.01
  Top 0.61: JP7.2 18.1,4.13 R4.1 | JP7.2 18.1,2.86 19.36,1.59 23.5,1.59 R6.1 26.04,2.23 29.53,5.71 C2.2 30.16,6.03 30.8,6.03 32.38,7.62 34.92,7.62 35.56,6.99 38.42,6.99 | U$4.2 37.2,15.83 | 37.2,15.83 37.15,15.88 34.29,15.88 | JP10.4 47.62,12.06 50.16,9.53 JP9.4 52.07,6.67 54.61,4.13 54.61,1.91 | 105.09,23.81 v106.68,25.4 114.3,25.4 115.25,24.45 115.25,23.5 | 34.29,15.88 33.66,15.24 33.66,13.97 33.02,13.34 C4.2 JP16.2 | 34.29,15.88 IC2.2 | v39.05,16.19 38.73,16.19 38.42,15.88 37.24,15.88 37.2,15.83 | R20.1 26.35,40.95 26.35,40.96 | JP8.6 18.41,62.23 19.05,62.87 29.53,62.87 | LED4.C 38.57,60.49 36.2,62.87 29.53,62.87
  Bottom 0.406: U$6.1 60.2,52.51
  Bottom 0.61: v39.05,30.48 v39.05,16.19 | v82.87,13.97 82.23,14.61 82.23,26.04 v81.92,26.35 86.04,30.48 97.16,30.48 100.97,26.67 106.68,26.67 | v60.96,14.92 60.96,14.6 61.91,13.65 v66.04,9.53 | 60.2,52.51 60.96,51.75 66.52,51.75 C10.- 66.67,53.34 | v49.53,50.8 46.67,50.8 46.2,51.27 46.2,52.07 | U$6.29 46.2,52.07 | R16.1 68.58,60.96 70.8,60.96 71.75,60.01 71.75,58.1 70.17,56.52 v70.17,53.34 66.67,53.34 | C9.- 66.67,53.34 | 46.2,52.07 41.59,52.07 40.32,53.34 | 40.32,53.34 31.75,53.34 29.53,55.56 v29.53,60.01 | C11.2 40.32,53.34 | 109.22,34.29 109.22,38.73 106.72,41.23 106.72,45.68 | 109.22,34.29 112.39,34.29 114.3,32.38 114.3,28.57 112.39,26.67 106.68,26.67 | v106.68,25.4 106.68,26.67 | 109.22,34.29 109.22,31.11
GPS_1PPS
  Top 0.406: U2.31 66.16,24.33 67.63,22.86 86.04,22.86 92.08,28.89 JP15.7
GPS_BCKP_SWTCH
  Top 0.406: U2.28 63.76,22.92 66.67,20 87,20 95.57,28.57 95.57,44.77 91.76,48.58 87.95,48.58 83.77,44.4 Q11.1
GPS_FORCE_ONE
  Top 0.406: U2.30 65.36,23.86 67.31,21.91 86.36,21.91 93.66,29.21 93.66,36.51 93.03,37.15 JP15.5
GPS_RXD
  Top 0.406: U2.43 82.96,35.34 87.31,39.69 JP15.4
GPS_SWTCH
  Top 0.406: U2.29 64.56,23.39 66.99,20.95 86.68,20.95 94.61,28.89 94.61,43.54 Q10.1
GPS_TXD
  Top 0.406: U2.42 83.43,34.54 86.04,37.15 JP15.6
I2C2_SCL  (via drill 0.9)
  Top 0.406: JP10.3 50.16,13.34 v49.53,12.7 | v47.62,22.54 47.95,22.86 R24.1 52.07,22.86 54.75,25.54 U2.17 | JP9.3 47.62,9.21 v46.35,10.48
  Bottom 0.406: v47.62,22.54 47.94,22.54 52.07,18.41 52.07,12.7 | v49.53,12.7 52.07,12.7 | 52.07,12.7 53.02,12.7 53.66,12.06 53.66,10.16 53.02,9.53 51.44,9.53 51.12,9.84 46.99,9.84 v46.35,10.48
I2C2_SDA  (via drill 0.9)
  Top 0.406: R23.1 45.09,25.72 45.4,26.04 v46.35,26.04 46.67,26.35 50.48,26.35 51.47,27.34 U2.16 | JP10.2 v44.13,17.46 | JP9.2 50.8,3.49 v53.34,2.22
  Bottom 0.406: v46.35,26.04 45.4,26.04 43.5,24.13 43.5,17.46 | v44.13,17.46 43.5,17.46 | 43.5,17.46 43.5,10.79 45.72,8.57 50.8,8.57 52.7,6.67 v53.34,2.22
I2C_SCL  (via drill 0.9)
  Top 0.406: U2.37 75.83,30.54 78.74,27.62 v78.74,26.35 | U$5.6 58.1,6.03 57.47,6.67 57.47,7.94 58.1,8.57 61.28,8.57 66.36,13.65 67.63,13.65 v67.63,13.97 R26.1 66.99,15.88 66.67,15.88 66.04,16.51 66.04,18.73 66.36,19.05 87.31,19.05 92.39,24.13 93.98,24.13 95.25,22.86 95.25,15.56 93.34,13.65 JP12.3
  Bottom 0.406: v78.74,26.35 78.74,17.14 75.25,13.65 67.63,13.65 v67.63,13.97
I2C_SDA  (via drill 0.9)
  Top 0.406: U2.36 75.03,29.74 77.15,27.62 v77.15,24.45 | 59.63,7.36 U$5.5 61.59,7.3 66.67,12.38 69.22,12.38 70.48,13.65 R25.1 73.98,15.88 v73.34,15.88 75.88,15.88 76.2,16.19 JP12.2
  Bottom 0.406: v77.15,24.45 77.15,17.14 75.88,15.88 v73.34,15.88
LED
  Top 0.406: U2.7 48.33,34.54 38.42,44.45 38.42,47.62 40.96,50.16 R22.2
MPU_INT  (via drill 0.9)
  Top 0.406: U2.38 76.61,31.34 80.33,27.62 v80.33,24.45 | v87,13.65 JP12.4
  Bottom 0.406: v80.33,24.45 80.33,13.97 82.23,12.06 85.41,12.06 v87,13.65
MPU_SWTCH  (via drill 0.9)
  Top 0.406: U2.39 77.4,32.14 81.28,28.26 82.55,28.26 84.45,26.35 v84.45,25.72 | Q9.1 93.03,22.23 v93.34,22.54
  Bottom 0.406: v84.45,25.72 87.63,22.54 v93.34,22.54
N$1
  Top 0.406: LED1.C 9.53,20.95 10.48,21.91 15.88,21.91 16.19,22.23 R1.1
N$2  (via drill 0.9)
  Top 0.305: U$1.2 U$1.1
  Top 0.406: JP1.P1 5.11,16.86 5.71,17.46
  Top 0.61: v25.08,21.91 25.08,19.68 | 25.08,19.68 25.08,18.73 25.72,18.1 25.72,16.19 25.4,15.88 25.4,15.78 U$1.1 | 7.3,18.73 7.94,18.73 10.31,16.36 10.63,16.03 10.93,15.69 10.93,13.15 9.65,11.88 C1.1 | 7.3,22.54 8.42,23.66 LED1.A LED2.A LED3.A 15.24,24.29 18.25,24.29 19.05,23.5 19.05,21.83 21.27,19.61 D1.A 25,19.61 25.08,19.68 | 7.3,22.54 7.3,18.73 | 5.71,17.46 5.71,17.78 6.67,18.73 7.3,18.73 | v28.89,21.91 28.89,19.68 Q1.1 | R7.2 7.3,22.54
  Bottom 0.61: v25.08,21.91 v28.89,21.91
N$3
  Top 0.61: U$5.1 67.94,3.49 68.26,3.81 C7.1 Q2.1
N$4
  Top 0.61: U$5.2 67.31,4.76 69.55,7 Q2.4 72.81,8.46 72.07,9.21 C8.1
N$5  (via drill 0.9)
  Top 0.61: U$5.3 66.67,6.03 68.26,7.62 68.26,9.21 v68.58,9.53
  Bottom 0.61: v68.58,9.53 70.48,11.43 JP4.2
N$6
  Top 0.406: LED2.C 12.06,19.37 13.02,18.41 R2.1
N$7  (via drill 0.9)
  Top 0.406: LED3.C 14.61,18.73 v15.56,17.78
  Bottom 0.406: R3.1 16.83,17.78 v15.56,17.78
N$8
  Top 0.305: U$1.6 23.77,9.48 23.5,9.21
  Top 0.406: R4.2 22.22,7.93 23.5,9.21
N$9
  Top 0.61: U$4.1 37.2,12.75 36.83,12.38 R12.2
N$10
  Top 0.305: U$1.8 24.77,9.84 24.77,9.53 25.08,9.21
  Top 0.406: 25.08,9.21 26.67,9.21 26.99,8.89 R5.2
N$11
  Top 0.61: 26.67,6.03 R5.1 26.99,5.71 25.39,4.12 R6.2 23.18,4.13 22.54,3.49 JP7.1
N$12  (via drill 1, 2.2)  (6 unrouted)
  other vias: 106.72,31.23 109.22,31.24 111.72,31.24 111.72,45.74 106.72,45.74 103.12,38.73 115.32,38.74
N$13  (1 unrouted)
N$17
  Top 0.61: R11.1 33.97,11.75 35.2,12.97 U$4.3
N$18  (1 unrouted)
  Top 0.61: R17.1 34.61,42.23 | 34.61,42.23 R18.1 34.61,39.37 35.56,38.42 C12.+ | C12.+ 35.56,37.15 35.69,36.83 C12.+ | IC1.6 34.61,42.23
N$19
  Bottom 0.406: U$6.3 59.2,51.92 60.64,50.48 64.14,50.48 65.56,49.06 C10.+
N$20
  Bottom 0.406: 50.16,56.83 50.7,56.29 U$6.20 50.7,53.44 50.8,53.34 51.03,53.34 U$6.19 U$6.21
  Bottom 0.61: C11.1 40.96,56.83 44.13,56.83 44.77,57.47 | 44.77,57.47 49.53,57.47 50.16,56.83 | Q4.3 44.81,57.52 44.77,57.47
N$21
  Top 0.61: R18.2 R17.2 36.51,43.5 35.24,44.77 | IC1.7 32.38,43.5 33.66,44.77 35.24,44.77 | 35.24,44.77 R19.2 35.24,47.94 34.92,48.26 L1.2
N$22
  Bottom 0.406: U$6.4 58.7,56.48 59.69,57.47 63.19,57.47 65.41,59.69 R16.2
N$23
  Top 0.61: IC1.8 31.75,44.77 33.66,46.67 R19.1
N$24
  Top 0.61: IC1.1 25.34,47.56 | L1.1 26.04,48.26 25.34,47.56 | D2.A 25.28,46.99 25.34,47.56
N$25
  Top 0.61: IC1.3 21.72,42.23 C14.1
N$26
  Top 0.61: IC1.5 30.54,40.26 31.43,39.37 31.43,39.05 R21.1 31.43,36.83 30.48,35.88 C15.1 28.45,31.75 23.81,31.75 23.5,32.07 23.5,35.56 24.45,36.52 R20.2
N$27
  Top 0.61: U1.4 3.6,37.26 2.86,36.51 2.86,32.38 4.44,30.8 C16.2 5.08,26.35 5.71,25.72 7.62,25.72 8.26,26.35 Q5.3
N$30
  Top 0.406: U2.58 59.76,45.47 61.59,47.31 62.87,47.31 65.09,49.53 Q8.2 68.9,49.54 68.9,50.8 69.53,51.44 C22.2
N$31
  Top 0.406: U2.59 58.96,49.1 Q8.1 59.05,49.86 59.05,50.8 C23.2
N$32
  Top 0.61: C5.1 40.01,21.27 41.91,19.37 L2.2 | 39.33,21.31 C5.1 | IC2.3 36.6,19.77 38.1,21.27 C5.1
N$33
  Top 0.406: LED4.A 40.8,56.99 40.96,56.83 R22.1
N$34
  Top 0.61: Q9.3 JP12.1
N$39
  Top 0.61: JP15.1 92.08,43.18 Q10.3
N$40
  Top 0.61: Q11.3 86.04,42.23 JP15.2
OLED_CS#  (via drill 0.9)
  Top 0.406: U2.6 48.8,35.34 39.37,44.77 39.37,46.67 40.64,47.94 v40.96,47.94
  Bottom 0.406: v40.96,47.94 40.96,48.26 41.27,48.58 49.53,48.58 52.2,51.25 U$6.17
OLED_D0  (via drill 0.9)
  Top 0.406: U2.62 56.56,42.82 55.24,44.13 52.39,44.13 51.44,45.09 49.85,45.09 45.4,49.53 45.4,56.2 49.53,60.33 54.61,60.33 v55.24,59.69
  Bottom 0.406: U$6.12 54.7,59.15 v55.24,59.69
OLED_D1  (via drill 0.9)
  Top 0.406: v48.26,44.77 48.9,44.13 51.12,44.13 51.95,43.3 54.49,43.3 55.76,42.03 U2.63
  Bottom 0.406: U$6.11 55.2,45.36 53.98,44.13 48.9,44.13 v48.26,44.77
OLED_D2  (via drill 0.9)
  Top 0.406: v57.47,60.33 57.47,60.64 56.83,61.28 48.9,61.28 44.45,56.83 44.45,48.58 46.67,46.35 46.67,43.81 47.31,43.18 50.8,43.18 51.47,42.51 53.9,42.51 54.96,41.45 U2.64
  Bottom 0.406: v57.47,60.33 57.47,59.69 55.7,57.93 U$6.10
OLED_D3  (via drill 0.9)
  Top 0.406: U2.1 51.15,39.34 49.85,40.64 v49.85,41.59
  Bottom 0.406: U$6.9 56.2,45.09 52.7,41.59 v49.85,41.59
OLED_D4  (via drill 0.9)
  Top 0.406: U2.2 50.68,38.54 45.72,43.5 45.72,45.72 43.5,47.94 43.5,57.47 48.26,62.23 58.1,62.23 v60.01,60.33
  Bottom 0.406: v60.01,60.33 58.74,59.05 58.1,59.05 56.7,57.66 U$6.8
OLED_D5  (via drill 0.9)
  Top 0.406: U2.3 50.21,37.74 44.13,43.81 v44.13,44.77
  Bottom 0.406: U$6.7 57.2,44.82 52.39,40.01 47.94,40.01 44.13,43.81 v44.13,44.77
OLED_D6  (via drill 0.9)
  Top 0.406: U2.4 49.74,36.94 42.55,44.13 42.55,58.1 47.62,63.18 59.69,63.18 v62.55,60.33
  Bottom 0.406: v62.55,60.33 60.64,58.42 59.05,58.42 57.7,57.07 U$6.6
OLED_D7  (via drill 0.9)
  Top 0.406: U2.5 49.27,36.14 41.59,43.81 41.59,45.09 v40.96,45.72
  Bottom 0.406: U$6.5 58.2,44.55 52.7,39.05 46.35,39.05 41.59,43.81 41.59,45.09 v40.96,45.72
OLED_D/C#  (via drill 0.9)
  Top 0.406: v50.16,46.67 49.85,46.67 46.99,49.53 46.99,52.39 50.48,55.88 74.93,55.88 75.88,54.93 75.88,44.45 70.77,39.34 U2.48
  Bottom 0.406: U$6.15 53.2,48.12 51.75,46.67 v50.16,46.67
OLED_E/RD#  (via drill 0.9)
  Top 0.406: v53.02,45.72 50.48,48.26 49.85,48.26 47.94,50.16 47.94,51.75 51.12,54.93 74.3,54.93 74.93,54.29 74.93,44.77 72.71,42.55 67.31,42.55 66.96,42.2 U2.49
  Bottom 0.406: U$6.13 54.2,46.9 v53.02,45.72
OLED_R/W#  (via drill 0.9)
  Top 0.406: U2.47 71.24,38.54 76.83,44.13 76.83,55.56 75.56,56.83 53.98,56.83 v53.02,57.78
  Bottom 0.406: U$6.14 53.7,57.1 v53.02,57.78
OLED_RES#  (via drill 0.9)
  Top 0.406: U2.46 71.71,37.74 77.79,43.81 77.79,56.2 76.2,57.78 54.93,57.78 53.34,59.37 51.44,59.37 v50.8,58.74
  Bottom 0.406: U$6.16 52.7,56.2 50.8,58.1 v50.8,58.74
OLED_SWTCH  (via drill 0.9)
  Top 0.406: U2.54 62.96,42.96 65.09,45.09 65.09,46.04 v65.41,46.35
  Bottom 0.406: Q4.1 40.32,58.74 39.37,59.69 39.37,60.96 40.32,61.91 71.12,61.91 72.71,60.33 72.71,57.47 71.75,56.52 71.75,50.48 67.63,46.35 v65.41,46.35
PDI_CLK/RESET  (via drill 0.9)
  Top 0.406: U2.57 60.56,44.05 v61.28,44.77 | C30.1 8.57,49.53 10.16,51.12 10.16,54.29 v12.7,56.83 13.97,58.1 15.88,58.1 | JP8.5 15.88,58.1 | R8.1 15.88,58.1
  Top 0.61: S1.2 2.54,50.48 3.5,49.53 C30.1
  Bottom 0.406: v61.28,44.77 60.96,44.77 53.34,37.15 44.13,37.15 25.4,55.88 17.46,55.88 16.51,56.83 v12.7,56.83
PDI_DATA  (via drill 0.8, 0.9)
  Top 0.406: U2.56 61.36,42.63 63.18,44.45 v63.18,45.72 | JP8.1 25.4,58.1 v26.99,56.52
  Bottom 0.406: v63.18,45.72 62.23,46.67 60.64,46.67 59.37,45.4 59.37,44.77 59.05,44.45 53.02,38.1 44.77,38.1 26.99,56.2 v26.99,56.52
POWER  (via drill 0.9)  (1 unrouted)
  Top 0.61: C4.1 31.98,15.33 IC2.1 31.98,19.46 31.11,20.32 31.11,22.86 JP5.2 | Q3.2 42.55,35.88 44.13,34.29 v44.13,33.66
  Bottom 0.61: v44.13,33.66 38.73,33.66 33.66,28.57
PWR_GOOD  (via drill 0.9)
  Top 0.305: U$1.7 24.27,9.07 24.45,8.89
  Top 0.406: 24.45,8.89 v24.45,6.99
  Bottom 0.406: v24.45,6.99 23.81,5.4 21.27,7.94 R3.2
RTC_OUT
  Top 0.406: U$5.7 58.1,4.76 55.88,6.99 R14.1 55.88,8.89 56.2,9.21 57.47,9.21 57.78,9.53 60.64,9.53 64.77,13.65 64.77,20.32 62.16,22.93 U2.26
SPI_MISO  (via drill 0.9)
  Top 0.406: U1.7 7.08,40.54 19.37,28.26 37.47,28.26 44.45,21.27 53.98,21.27 v56.2,19.05 | R13.1 56.83,14.92 v56.2,15.56 58.96,18.32 U2.22
  Bottom 0.406: v56.2,19.05 v56.2,15.56
SPI_MOSI
  Top 0.406: U1.3 8.92,36.17 18.73,26.35 36.83,26.35 43.81,19.37 51.12,19.37 53.02,17.46 54.29,17.46 | 54.29,17.46 56.83,17.46 58.16,18.79 U2.21 | R9.1 54.29,17.46
SPI_SCK  (via drill 0.9)
  Top 0.406: U2.23 59.76,16.9 v58.74,15.88 58.74,14.92 59.37,14.29 R15.1 | U1.5 8.04,38.31 19.05,27.3 37.15,27.3 44.13,20.32 52.7,20.32 v53.98,19.05
  Bottom 0.406: v53.98,19.05 53.98,15.24 55.24,13.97 57.15,13.97 58.74,15.56 v58.74,15.88
STAT1
  Top 0.305: U$1.3 24.77,16.51
  Top 0.406: 24.77,16.51 24.77,17.14 24.13,17.78 18.41,17.78 17.46,18.73 17.46,20.32 R1.2
STAT2
  Top 0.305: U$1.4 24.27,16.38 24.13,16.51
  Top 0.406: 24.13,16.51 23.81,16.83 17.14,16.83 15.88,15.56 R2.2
SW1  (via drill 0.9)  (1 unrouted)
  Top 0.406: U2.40 78.19,32.94 81.92,29.21 84.14,29.21 v86.04,27.3 | v96.52,25.08 98.11,23.5 100.65,23.5
  Bottom 0.406: v86.04,27.3 95.57,27.3 96.52,26.35 v96.52,25.08
SW2  (via drill 0.9)  (1 unrouted)
  Top 0.406: U2.41 78.97,33.74 82.23,30.48 86.04,30.48 v87.63,28.89 | v99.06,25.72 101.92,25.72 102.87,24.77 102.87,22.23 103.5,21.59 110.17,21.59 110.81,22.23 110.81,23.5
  Bottom 0.406: v87.63,28.89 95.89,28.89 v99.06,25.72
USB_D+  (via drill 0.9)
  Top 0.406: JP1.P3 6.35,15.56 6.99,14.92 v8.89,14.92 | U2.33 70.14,27.34 71.44,26.04 v71.44,24.13
  Bottom 0.406: v8.89,14.92 8.89,16.83 27.3,35.24 44.77,35.24 48.26,31.75 48.26,24.13 52.07,20.32 67.63,20.32 v71.44,24.13
USB_D-  (via drill 0.9)
  Top 0.406: JP1.P2 6.33,16.21 6.67,16.19 v7.3,16.83 | U2.32 69.39,25.54 v69.53,25.4
  Bottom 0.406: v7.3,16.83 7.62,16.83 26.99,36.2 45.09,36.2 49.21,32.07 49.21,24.45 52.39,21.27 65.41,21.27 v69.53,25.4
USD_CS  (via drill 0.9)
  Top 0.406: U2.8 47.54,33.74 41.59,39.69 v39.37,39.69 | U1.2 6.17,35.11 6.67,34.61 v6.67,27.62
  Bottom 0.406: v39.37,39.69 18.73,39.69 v6.67,27.62
USD_SWTCH  (via drill 0.9)
  Top 0.406: U2.9 47.07,32.94 42.23,37.78 v40.96,37.78 | Q5.1 13.97,25.4 v14.92,26.35
  Bottom 0.406: v40.96,37.78 27.3,37.78 15.88,26.35 v14.92,26.35
V+  (via drill 0.9)  (1 unrouted)
  Top 0.406: U2.61 57.36,43.92
  Top 0.61: 57.36,43.92 53.98,47.31 C27.1 | C27.1 | C29.1 41.27,4.76 42.41,5.9 L3.1 43.18,5.58 v43.18,3.49 | v51.75,48.9 C27.1
(copper drawn outside any net)
  shapes: Top area x8

### Text on the board
Top: v1.0.x